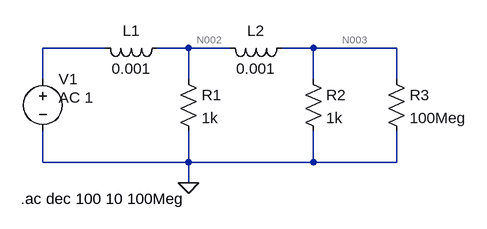
[diagram p0: schematic Aufgabe1.asc]
Aufgabe1.asc, the LTspice schematic file:
Version 4
SHEET 1 880 680
WIRE 128 80 32 80
WIRE 256 80 208 80
WIRE 320 80 256 80
WIRE 448 80 400 80
WIRE 576 80 448 80
WIRE 32 128 32 80
WIRE 256 128 256 80
WIRE 448 128 448 80
WIRE 576 128 576 80
WIRE 32 256 32 208
WIRE 256 256 256 208
WIRE 256 256 32 256
WIRE 448 256 448 208
WIRE 448 256 256 256
WIRE 576 256 576 208
WIRE 576 256 448 256
WIRE 256 288 256 256
FLAG 256 288 0
SYMBOL voltage 32 112 R0
WINDOW 123 24 44 Left 2
WINDOW 39 0 0 Left 0
SYMATTR InstName V1
SYMATTR Value ""
SYMATTR Value2 AC 1
SYMBOL ind 224 64 R90
WINDOW 0 5 56 VBottom 2
WINDOW 3 32 56 VTop 2
SYMATTR InstName L1
SYMATTR Value 0.001
SYMBOL res 240 112 R0
SYMATTR InstName R1
SYMATTR Value 1k
SYMBOL ind 416 64 R90
WINDOW 0 5 56 VBottom 2
WINDOW 3 32 56 VTop 2
SYMATTR InstName L2
SYMATTR Value 0.001
SYMBOL res 432 112 R0
SYMATTR InstName R2
SYMATTR Value 1k
SYMBOL res 560 112 R0
SYMATTR InstName R3
SYMATTR Value 100Meg
TEXT -2 312 Left 2 !.ac dec 100 10 100Meg

The netlist it stands for:
* Aufgabe1.asc
V1 N001 0 AC 1
L1 N002 N001 0.001
R1 N002 0 1k
L2 N003 N002 0.001
R2 N003 0 1k
R3 N003 0 100Meg
.ac dec 100 10 100Meg
.backanno
.end

* Results of the author's LTspice run, read from the files saved beside the schematic
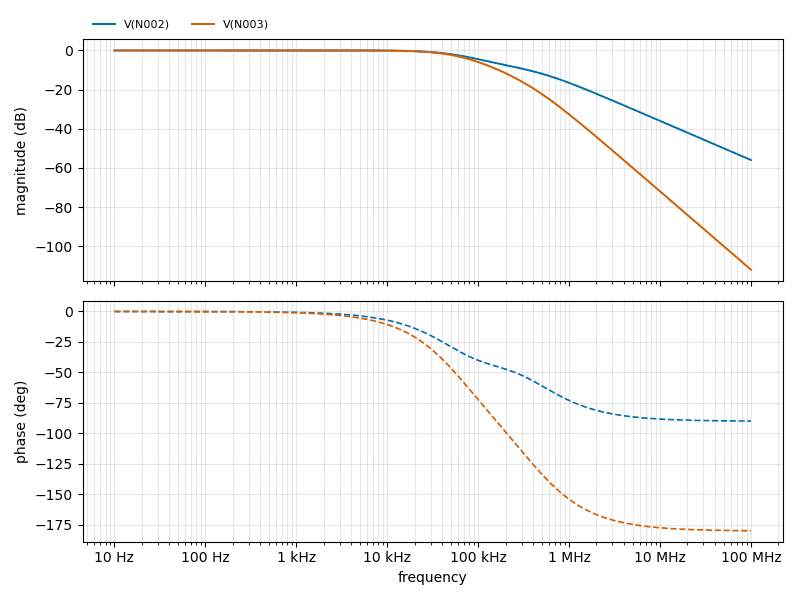
[diagram p1: AC Analysis of Aufgabe1.asc, plotted from the saved traces]
* AC Analysis, 1 run:
*   V(N002): -0.00 dB at 10 Hz, -55.96 dB at 100 MHz, peak -0.00 dB at 10 Hz, 3 dB below the peak at 69.84 kHz
*   V(N003): -0.00 dB at 10 Hz, -111.93 dB at 100 MHz, peak -0.00 dB at 10 Hz, 3 dB below the peak at 59.56 kHz